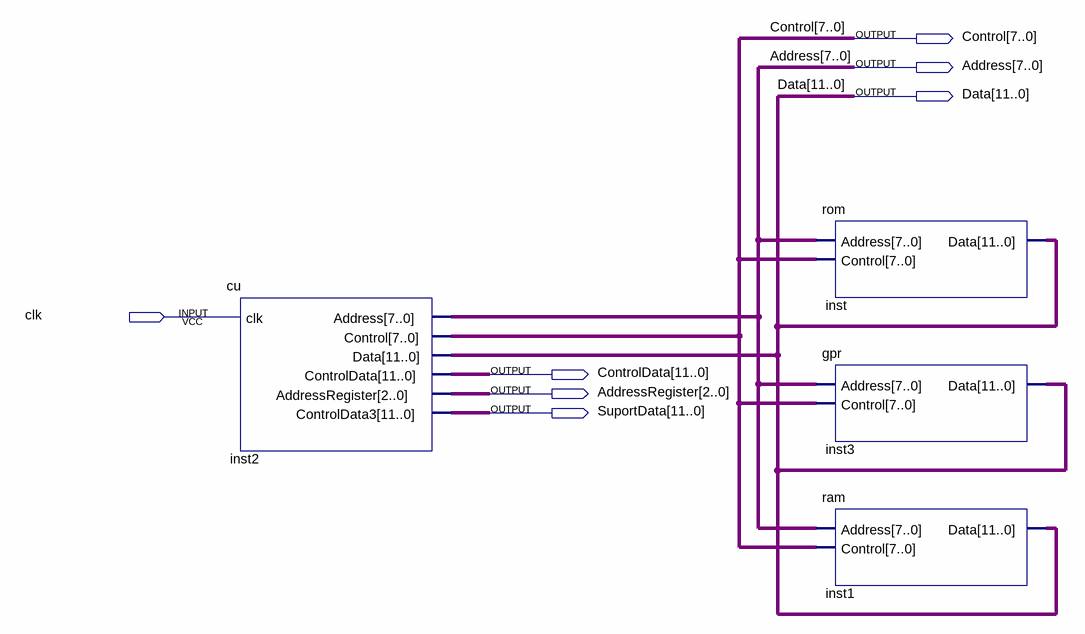
[diagram p0: schematic sheet]
// Quartus schematic main.bdf as structural Verilog: 4 symbols, 7 pins
module main (
  input  clk,
  output [7:0] Control,
  output [7:0] Address,
  output [11:0] Data,
  output [11:0] ControlData,
  output [2:0] AddressRegister,
  output [11:0] SuportData
);

  cu inst2 (
    .clk(clk), .Address(Address), .Control(Control), .ControlData(ControlData),
    .AddressRegister(AddressRegister), .ControlData3(SuportData), .Data(Data));
  rom inst (.Address(Address), .Control(Control), .Data(Data));
  gpr inst3 (.Address(Address), .Control(Control), .Data(Data));
  ram inst1 (.Address(Address), .Control(Control), .Data(Data));
endmodule
